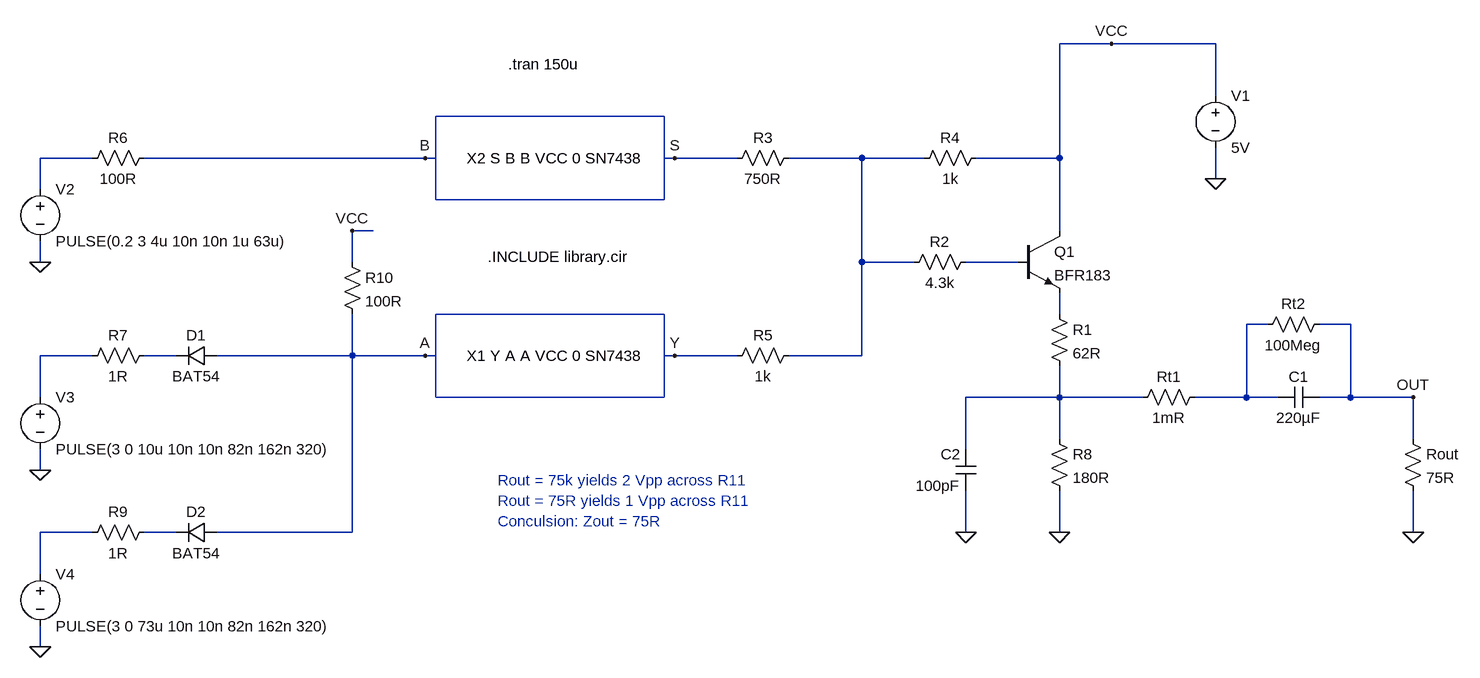
[diagram p0: schematic composite_video.asc]
composite_video.asc, the LTspice schematic file:
Version 4
SHEET 1 2784 4832
WIRE 432 -176 352 -176
WIRE 592 -176 432 -176
WIRE 592 -96 592 -176
WIRE -1136 0 -1216 0
WIRE -624 0 -1056 0
WIRE -608 0 -624 0
WIRE -240 0 -256 0
WIRE -144 0 -240 0
WIRE 48 0 -64 0
WIRE 144 0 48 0
WIRE 352 0 352 -176
WIRE 352 0 224 0
WIRE 592 32 592 -16
WIRE -1216 48 -1216 0
WIRE -704 112 -736 112
WIRE 352 112 352 0
WIRE -1216 160 -1216 128
WIRE -736 160 -736 112
WIRE 48 160 48 0
WIRE 128 160 48 160
WIRE 288 160 208 160
WIRE 352 240 352 208
WIRE 672 256 640 256
WIRE 800 256 752 256
WIRE -1136 304 -1216 304
WIRE -1008 304 -1056 304
WIRE -736 304 -736 240
WIRE -736 304 -944 304
WIRE -624 304 -736 304
WIRE -608 304 -624 304
WIRE -240 304 -256 304
WIRE -144 304 -240 304
WIRE 48 304 48 160
WIRE 48 304 -64 304
WIRE -1216 368 -1216 304
WIRE 352 368 352 320
WIRE 352 368 208 368
WIRE 480 368 352 368
WIRE 640 368 640 256
WIRE 640 368 560 368
WIRE 688 368 640 368
WIRE 800 368 800 256
WIRE 800 368 752 368
WIRE 896 368 800 368
WIRE 352 432 352 368
WIRE 896 432 896 368
WIRE 208 448 208 368
WIRE -1216 480 -1216 448
WIRE -1136 576 -1216 576
WIRE -1008 576 -1056 576
WIRE -736 576 -736 304
WIRE -736 576 -944 576
WIRE 208 576 208 512
WIRE 352 576 352 512
WIRE 896 576 896 512
WIRE -1216 640 -1216 576
WIRE -1216 752 -1216 720
FLAG 352 576 0
FLAG 592 32 0
FLAG -1216 480 0
FLAG -1216 160 0
FLAG -624 304 A
FLAG -240 304 Y
FLAG 432 -176 VCC
FLAG -240 0 S
FLAG -624 0 B
FLAG -1216 752 0
FLAG 896 576 0
FLAG -736 112 VCC
FLAG 896 368 OUT
FLAG 208 576 0
SYMBOL npn 288 112 R0
SYMATTR InstName Q1
SYMATTR Value BFR183
SYMBOL res 224 144 R90
WINDOW 0 0 56 VBottom 2
WINDOW 3 32 56 VTop 2
SYMATTR InstName R2
SYMATTR Value 4.3k
SYMBOL res 128 16 R270
WINDOW 0 32 56 VTop 2
WINDOW 3 0 56 VBottom 2
SYMATTR InstName R4
SYMATTR Value 1k
SYMBOL res -48 -16 R90
WINDOW 0 0 56 VBottom 2
WINDOW 3 32 56 VTop 2
SYMATTR InstName R3
SYMATTR Value 750R
SYMBOL res -48 288 R90
WINDOW 0 0 56 VBottom 2
WINDOW 3 32 56 VTop 2
SYMATTR InstName R5
SYMATTR Value 1k
SYMBOL voltage 592 -112 R0
SYMATTR InstName V1
SYMATTR Value 5V
SYMBOL res -1040 -16 R90
WINDOW 0 0 56 VBottom 2
WINDOW 3 32 56 VTop 2
SYMATTR InstName R6
SYMATTR Value 100R
SYMBOL res -1040 288 R90
WINDOW 0 0 56 VBottom 2
WINDOW 3 32 56 VTop 2
SYMATTR InstName R7
SYMATTR Value 1R
SYMBOL voltage -1216 32 R0
WINDOW 123 0 0 Left 0
WINDOW 39 0 0 Left 0
SYMATTR InstName V2
SYMATTR Value PULSE(0.2 3 4u 10n 10n 1u 63u)
SYMBOL voltage -1216 352 R0
WINDOW 123 0 0 Left 0
WINDOW 39 0 0 Left 0
SYMATTR InstName V3
SYMATTR Value PULSE(3 0 10u 10n 10n 82n 162n 320)
SYMBOL res 336 224 R0
SYMATTR InstName R1
SYMATTR Value 62R
SYMBOL res 336 416 R0
SYMATTR InstName R8
SYMATTR Value 180R
SYMBOL res -1040 560 R90
WINDOW 0 0 56 VBottom 2
WINDOW 3 32 56 VTop 2
SYMATTR InstName R9
SYMATTR Value 1R
SYMBOL voltage -1216 624 R0
WINDOW 123 0 0 Left 0
WINDOW 39 0 0 Left 0
SYMATTR InstName V4
SYMATTR Value PULSE(3 0 73u 10n 10n 82n 162n 320)
SYMBOL diode -944 288 R90
WINDOW 0 0 32 VBottom 2
WINDOW 3 32 32 VTop 2
SYMATTR InstName D1
SYMATTR Value BAT54
SYMBOL diode -944 560 R90
WINDOW 0 0 32 VBottom 2
WINDOW 3 32 32 VTop 2
SYMATTR InstName D2
SYMATTR Value BAT54
SYMBOL res -752 144 R0
SYMATTR InstName R10
SYMATTR Value 100R
SYMBOL cap 752 352 R90
WINDOW 0 0 32 VBottom 2
WINDOW 3 32 32 VTop 2
SYMATTR InstName C1
SYMATTR Value 220µF
SYMBOL res 880 416 R0
SYMATTR InstName Rout
SYMATTR Value 75R
SYMBOL res 576 352 R90
WINDOW 0 0 56 VBottom 2
WINDOW 3 32 56 VTop 2
SYMATTR InstName Rt1
SYMATTR Value 1mR
SYMBOL res 768 240 R90
WINDOW 0 0 56 VBottom 2
WINDOW 3 32 56 VTop 2
SYMATTR InstName Rt2
SYMATTR Value 100Meg
SYMBOL cap 224 512 R180
WINDOW 0 24 56 Left 2
WINDOW 3 24 8 Left 2
SYMATTR InstName C2
SYMATTR Value 100pF
TEXT -496 -144 Left 2 !.tran 150u
TEXT -528 152 Left 2 !.INCLUDE library.cir
TEXT -512 496 Left 2 ;Rout = 75k yields 2 Vpp across R11\nRout = 75R yields 1 Vpp across R11\nConculsion: Zout = 75R
TEXT -560 0 Left 2 !X2 S B B VCC 0 SN7438
TEXT -560 304 Left 2 !X1 Y A A VCC 0 SN7438
RECTANGLE Normal -256 368 -608 240
RECTANGLE Normal -256 64 -608 -64

The netlist it stands for:
* composite_video.asc
Q1 VCC N003 N004 0 BFR183
R2 N003 N002 4.3k
R4 N002 VCC 1k
R3 N002 S 750R
R5 N002 Y 1k
V1 VCC 0 5V
R6 B N001 100R
R7 N007 N006 1R
V2 N001 0 PULSE(0.2 3 4u 10n 10n 1u 63u)
V3 N006 0 PULSE(3 0 10u 10n 10n 82n 162n 320)
R1 N004 N008 62R
R8 N008 0 180R
R9 N010 N009 1R
V4 N009 0 PULSE(3 0 73u 10n 10n 82n 162n 320)
D1 A N007 BAT54
D2 A N010 BAT54
R10 VCC A 100R
C1 OUT N005 220µF
Rout OUT 0 75R
Rt1 N005 N008 1mR
Rt2 OUT N005 100Meg
C2 0 N008 100pF
.model D D
.lib standard.dio
.model NPN NPN
.model PNP PNP
.lib standard.bjt
.tran 150u
.INCLUDE library.cir
* Rout = 75k yields 2 Vpp across R11
* Rout = 75R yields 1 Vpp across R11
* Conculsion: Zout = 75R
X2 S B B VCC 0 SN7438
X1 Y A A VCC 0 SN7438
.backanno
.end